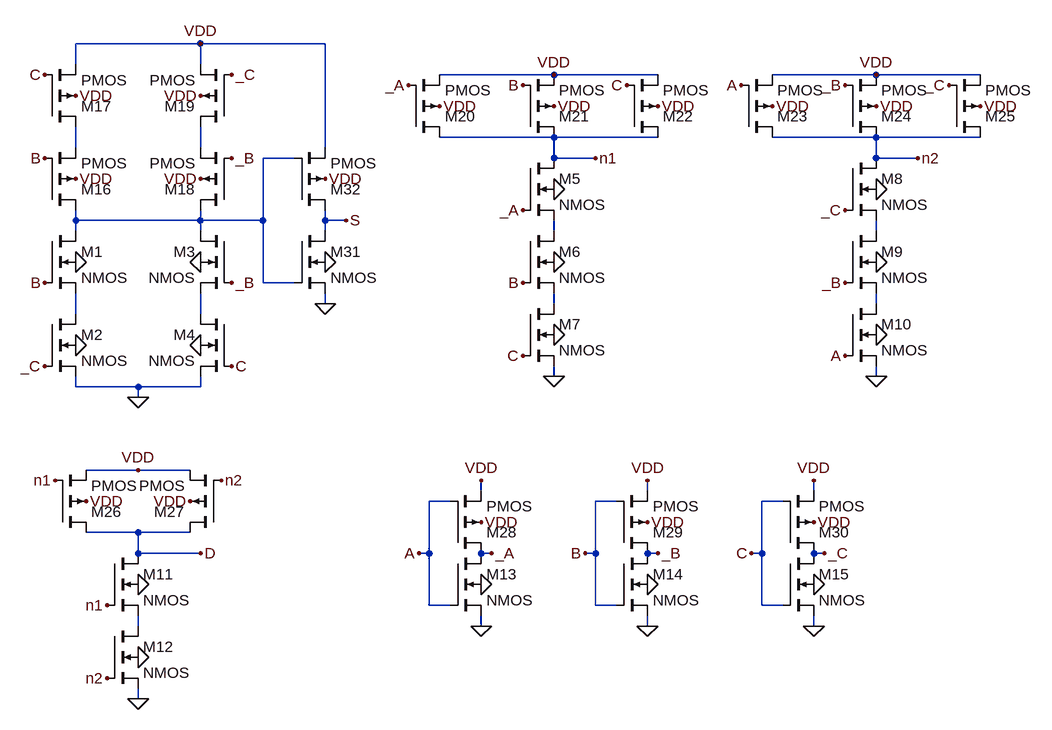
[diagram p0: schematic Encoder-v1.asc]
Encoder-v1.asc, the LTspice schematic file:
Version 4
SHEET 1 1408 700
WIRE -416 -336 -608 -336
WIRE -224 -336 -416 -336
WIRE -608 -304 -608 -336
WIRE -416 -304 -416 -336
WIRE 128 -288 -48 -288
WIRE 288 -288 128 -288
WIRE 624 -288 464 -288
WIRE 784 -288 624 -288
WIRE 128 -192 -48 -192
WIRE 288 -192 128 -192
WIRE 624 -192 464 -192
WIRE 784 -192 624 -192
WIRE -608 -176 -608 -208
WIRE -416 -176 -416 -208
WIRE -224 -176 -224 -336
WIRE -272 -160 -320 -160
WIRE 128 -160 128 -192
WIRE 192 -160 128 -160
WIRE 624 -160 624 -192
WIRE 688 -160 624 -160
WIRE -608 -64 -608 -80
WIRE -416 -64 -416 -80
WIRE -416 -64 -608 -64
WIRE -320 -64 -320 -160
WIRE -320 -64 -416 -64
WIRE -224 -64 -224 -80
WIRE -192 -64 -224 -64
WIRE -608 -48 -608 -64
WIRE -416 -48 -416 -64
WIRE -224 -48 -224 -64
WIRE 128 -48 128 -64
WIRE 624 -48 624 -64
WIRE -320 32 -320 -64
WIRE -272 32 -320 32
WIRE -224 64 -224 48
WIRE 128 64 128 48
WIRE 624 64 624 48
WIRE -608 80 -608 48
WIRE -416 80 -416 48
WIRE 128 176 128 160
WIRE 624 176 624 160
WIRE -608 192 -608 176
WIRE -512 192 -608 192
WIRE -416 192 -416 176
WIRE -416 192 -512 192
WIRE -512 208 -512 192
WIRE -512 320 -592 320
WIRE -432 320 -512 320
WIRE 16 352 16 336
WIRE 272 352 272 336
WIRE 528 352 528 336
WIRE -32 368 -64 368
WIRE 224 368 192 368
WIRE 480 368 448 368
WIRE -512 416 -592 416
WIRE -432 416 -512 416
WIRE -512 448 -512 416
WIRE -416 448 -512 448
WIRE -64 448 -64 368
WIRE -64 448 -80 448
WIRE 16 448 16 432
WIRE 32 448 16 448
WIRE 192 448 192 368
WIRE 192 448 176 448
WIRE 272 448 272 432
WIRE 288 448 272 448
WIRE 448 448 448 368
WIRE 448 448 432 448
WIRE 528 448 528 432
WIRE 544 448 528 448
WIRE -64 528 -64 448
WIRE -32 528 -64 528
WIRE 192 528 192 448
WIRE 224 528 192 528
WIRE 448 528 448 448
WIRE 480 528 448 528
WIRE -512 560 -512 544
WIRE 16 560 16 544
WIRE 272 560 272 544
WIRE 528 560 528 544
WIRE -512 672 -512 656
FLAG 128 176 0
FLAG 624 176 0
FLAG 624 112 0
FLAG 624 0 0
FLAG 624 -112 0
FLAG -512 496 0
FLAG -512 608 0
FLAG 128 -112 0
FLAG 128 0 0
FLAG -512 672 0
FLAG -512 208 0
FLAG 16 496 0
FLAG 16 560 0
FLAG 272 560 0
FLAG 528 560 0
FLAG 528 496 0
FLAG 272 496 0
FLAG -224 0 0
FLAG -224 64 0
FLAG 128 112 0
FLAG -608 0 0
FLAG -608 128 0
FLAG -416 128 0
FLAG -416 0 0
FLAG -416 -336 VDD
FLAG -608 -256 VDD
FLAG -416 -256 VDD
FLAG -416 -128 VDD
FLAG -608 -128 VDD
FLAG -224 -128 VDD
FLAG -48 -240 VDD
FLAG 128 -240 VDD
FLAG 288 -240 VDD
FLAG 464 -240 VDD
FLAG 624 -240 VDD
FLAG 784 -240 VDD
FLAG 528 400 VDD
FLAG 272 400 VDD
FLAG 16 400 VDD
FLAG -432 368 VDD
FLAG -592 368 VDD
FLAG 128 -288 VDD
FLAG 624 -288 VDD
FLAG 528 336 VDD
FLAG 272 336 VDD
FLAG 16 336 VDD
FLAG -512 320 VDD
FLAG -80 448 A
FLAG 32 448 _A
FLAG 176 448 B
FLAG 288 448 _B
FLAG 432 448 C
FLAG 544 448 _C
FLAG -656 -160 B
FLAG -656 32 B
FLAG -656 -288 C
FLAG -368 160 C
FLAG -368 32 _B
FLAG -368 -160 _B
FLAG -656 160 _C
FLAG -368 -288 _C
FLAG -192 -64 S
FLAG -96 -272 _A
FLAG 80 -80 _A
FLAG 80 -272 B
FLAG 80 32 B
FLAG 80 144 C
FLAG 240 -272 C
FLAG 416 -272 A
FLAG 576 144 A
FLAG 576 -272 _B
FLAG 576 32 _B
FLAG 576 -80 _C
FLAG 736 -272 _C
FLAG 192 -160 n1
FLAG -640 336 n1
FLAG -560 528 n1
FLAG 688 -160 n2
FLAG -560 640 n2
FLAG -384 336 n2
FLAG -416 448 D
SYMBOL nmos4 -656 -48 R0
SYMATTR InstName M1
SYMBOL nmos4 -656 80 R0
SYMATTR InstName M2
SYMBOL nmos4 -368 -48 M0
SYMATTR InstName M3
SYMBOL nmos4 -368 80 M0
SYMATTR InstName M4
SYMBOL nmos4 80 -160 R0
SYMATTR InstName M5
SYMBOL nmos4 80 -48 R0
SYMATTR InstName M6
SYMBOL nmos4 80 64 R0
SYMATTR InstName M7
SYMBOL nmos4 576 -160 R0
SYMATTR InstName M8
SYMBOL nmos4 576 -48 R0
SYMATTR InstName M9
SYMBOL nmos4 576 64 R0
SYMATTR InstName M10
SYMBOL nmos4 -560 448 R0
SYMATTR InstName M11
SYMBOL nmos4 -560 560 R0
SYMATTR InstName M12
SYMBOL nmos4 -32 448 R0
SYMATTR InstName M13
SYMBOL nmos4 224 448 R0
SYMATTR InstName M14
SYMBOL nmos4 480 448 R0
SYMATTR InstName M15
SYMBOL pmos4 -656 -80 M180
SYMATTR InstName M16
SYMBOL pmos4 -656 -208 M180
SYMATTR InstName M17
SYMBOL pmos4 -368 -80 R180
SYMATTR InstName M18
SYMBOL pmos4 -368 -208 R180
SYMATTR InstName M19
SYMBOL pmos4 -96 -192 M180
SYMATTR InstName M20
SYMBOL pmos4 80 -192 M180
SYMATTR InstName M21
SYMBOL pmos4 240 -192 M180
SYMATTR InstName M22
SYMBOL pmos4 416 -192 M180
SYMATTR InstName M23
SYMBOL pmos4 576 -192 M180
SYMATTR InstName M24
SYMBOL pmos4 736 -192 M180
SYMATTR InstName M25
SYMBOL pmos4 -640 416 M180
SYMATTR InstName M26
SYMBOL pmos4 -384 416 R180
SYMATTR InstName M27
SYMBOL pmos4 -32 448 M180
SYMATTR InstName M28
SYMBOL pmos4 224 448 M180
SYMATTR InstName M29
SYMBOL pmos4 480 448 M180
SYMATTR InstName M30
SYMBOL nmos4 -272 -48 R0
SYMATTR InstName M31
SYMBOL pmos4 -272 -80 M180
SYMATTR InstName M32

The netlist it stands for:
* Encoder-v1.asc
M1 N003 B N008 0 NMOS
M2 N008 _C 0 0 NMOS
M3 N003 _B N009 0 NMOS
M4 N009 C 0 0 NMOS
M5 n1 _A N004 0 NMOS
M6 N004 B N006 0 NMOS
M7 N006 C 0 0 NMOS
M8 n2 _C N005 0 NMOS
M9 N005 _B N007 0 NMOS
M10 N007 A 0 0 NMOS
M11 D n1 N010 0 NMOS
M12 N010 n2 0 0 NMOS
M13 _A A 0 0 NMOS
M14 _B B 0 0 NMOS
M15 _C C 0 0 NMOS
M16 N003 B N001 VDD PMOS
M17 N001 C VDD VDD PMOS
M18 N003 _B N002 VDD PMOS
M19 N002 _C VDD VDD PMOS
M20 n1 _A VDD VDD PMOS
M21 n1 B VDD VDD PMOS
M22 n1 C VDD VDD PMOS
M23 n2 A VDD VDD PMOS
M24 n2 _B VDD VDD PMOS
M25 n2 _C VDD VDD PMOS
M26 D n1 VDD VDD PMOS
M27 D n2 VDD VDD PMOS
M28 _A A VDD VDD PMOS
M29 _B B VDD VDD PMOS
M30 _C C VDD VDD PMOS
M31 S N003 0 0 NMOS
M32 S N003 VDD VDD PMOS
.model NMOS NMOS
.model PMOS PMOS
.lib standard.mos
.backanno
.end